# Altium project Jetson Carrier.PrjPcb
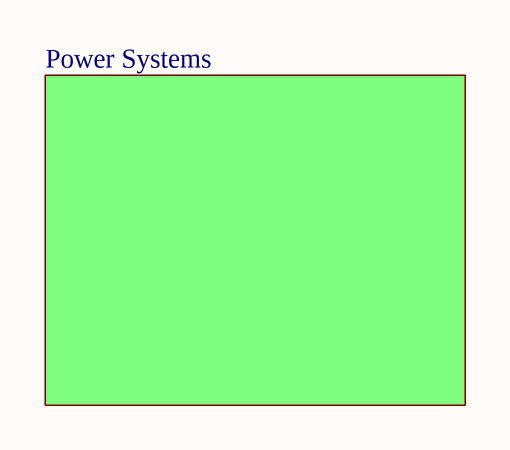
[diagram p0: 01_TOP_LEVEL.SchDoc]
3 sheets, 2 parts. Net scope: flat (ports and power ports of the same name join across sheets).
Sheets:
  01_TOP_LEVEL.SchDoc
    Power Systems = 02_POWER_SYSTEMS.SchDoc
      Module Power = 03_MODULE_POWER.SchDoc

## Sheet 01_TOP_LEVEL.SchDoc
size A4; SheetNumber: 1; SheetTotal: 3

### Sub-sheets
Power Systems = 02_POWER_SYSTEMS: no entries

## Sheet 02_POWER_SYSTEMS.SchDoc
size A4; SheetNumber: 2; SheetTotal: 3
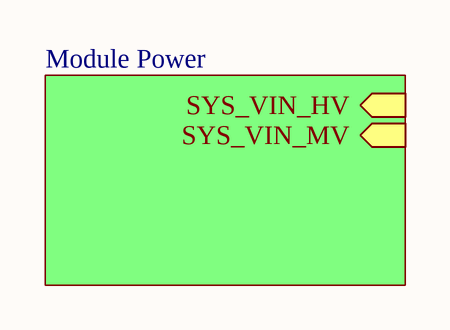
[diagram p1: 02_POWER_SYSTEMS.SchDoc]

### Sub-sheets
Module Power = 03_MODULE_POWER: SYS_VIN_HV (in), SYS_VIN_MV (in)

## Sheet 03_MODULE_POWER.SchDoc
size A4; SheetNumber: 3; SheetTotal: 3
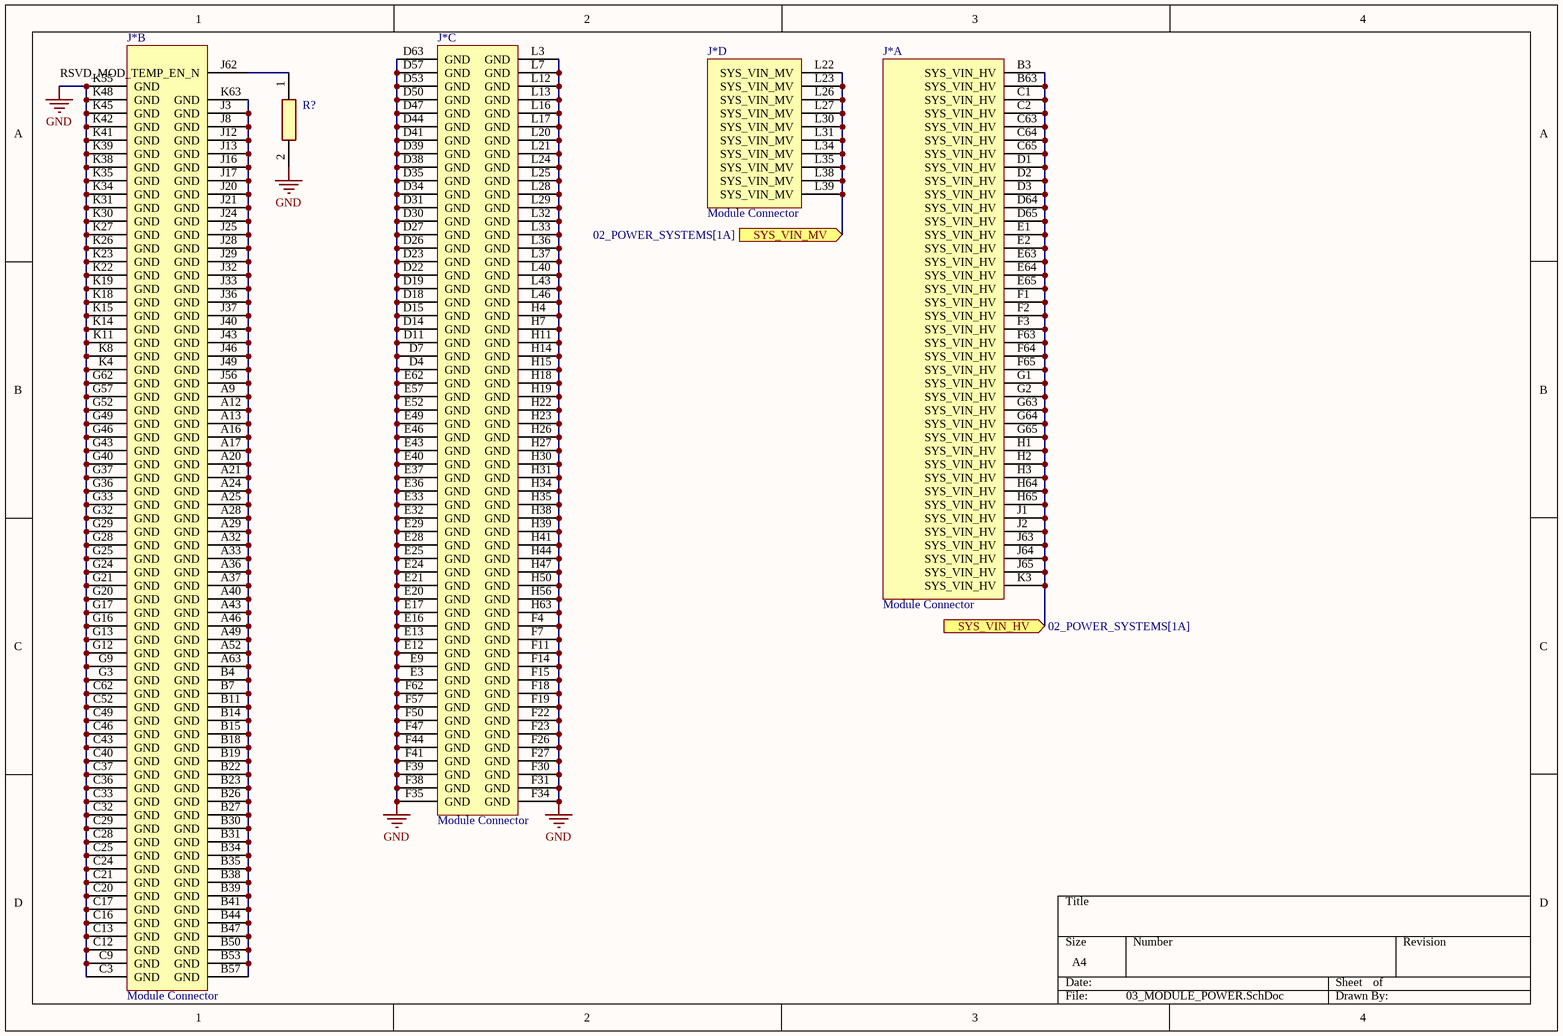
[diagram p2: 03_MODULE_POWER.SchDoc]

### Parts
J*  Module Connector  [2048430001]  (parts A,B,C,D of 4)
R?  0402WGF0000TCE  [RESC1005X40N]  (value not drawn)

### Ports
SYS_VIN_HV (in, see 02_POWER_SYSTEMS[1A]), SYS_VIN_MV (in, see 02_POWER_SYSTEMS[1A])

### Nets
GND: J*.C3(GND) J*.C9(GND) J*.C12(GND) J*.C13(GND) J*.C16(GND) J*.C17(GND) J*.C20(GND) J*.C21(GND) J*.C24(GND) J*.C25(GND) J*.C28(GND) J*.C29(GND) J*.C32(GND) J*.C33(GND) J*.C36(GND) J*.C37(GND) J*.C40(GND) J*.C43(GND) J*.C46(GND) J*.C49(GND) J*.C52(GND) J*.C62(GND) J*.D4(GND) J*.D7(GND) J*.D11(GND) J*.D14(GND) J*.D15(GND) J*.D18(GND) J*.D19(GND) J*.D22(GND) J*.D23(GND) J*.D26(GND) J*.D27(GND) J*.D30(GND) J*.D31(GND) J*.D34(GND) J*.D35(GND) J*.D38(GND) J*.D39(GND) J*.D41(GND) J*.D44(GND) J*.D47(GND) J*.D50(GND) J*.D53(GND) J*.D57(GND) J*.D63(GND) J*.E3(GND) J*.E9(GND) J*.E12(GND) J*.E13(GND) J*.E16(GND) J*.E17(GND) J*.E20(GND) J*.E21(GND) J*.E24(GND) J*.E25(GND) J*.E28(GND) J*.E29(GND) J*.E32(GND) J*.E33(GND) J*.E36(GND) J*.E37(GND) J*.E40(GND) J*.E43(GND) J*.E46(GND) J*.E49(GND) J*.E52(GND) J*.E57(GND) J*.E62(GND) J*.F4(GND) J*.F7(GND) J*.F11(GND) J*.F14(GND) J*.F15(GND) J*.F18(GND) J*.F19(GND) J*.F22(GND) J*.F23(GND) J*.F26(GND) J*.F27(GND) J*.F30(GND) J*.F31(GND) J*.F34(GND) J*.F35(GND) J*.F38(GND) J*.F39(GND) J*.F41(GND) J*.F44(GND) J*.F47(GND) J*.F50(GND) J*.F57(GND) J*.F62(GND) J*.G3(GND) J*.G9(GND) J*.G12(GND) J*.G13(GND) J*.G16(GND) J*.G17(GND) J*.G20(GND) J*.G21(GND) J*.G24(GND) J*.G25(GND) J*.G28(GND) J*.G29(GND) J*.G32(GND) J*.G33(GND) J*.G36(GND) J*.G37(GND) J*.G40(GND) J*.G43(GND) J*.G46(GND) J*.G49(GND) J*.G52(GND) J*.G57(GND) J*.G62(GND) J*.H4(GND) J*.H7(GND) J*.H11(GND) J*.H14(GND) J*.H15(GND) J*.H18(GND) J*.H19(GND) J*.H22(GND) J*.H23(GND) J*.H26(GND) J*.H27(GND) J*.H30(GND) J*.H31(GND) J*.H34(GND) J*.H35(GND) J*.H38(GND) J*.H39(GND) J*.H41(GND) J*.H44(GND) J*.H47(GND) J*.H50(GND) J*.H56(GND) J*.H63(GND) J*.K4(GND) J*.K8(GND) J*.K11(GND) J*.K14(GND) J*.K15(GND) J*.K18(GND) J*.K19(GND) J*.K22(GND) J*.K23(GND) J*.K26(GND) J*.K27(GND) J*.K30(GND) J*.K31(GND) J*.K34(GND) J*.K35(GND) J*.K38(GND) J*.K39(GND) J*.K41(GND) J*.K42(GND) J*.K45(GND) J*.K48(GND) J*.K55(GND) J*.L3(GND) J*.L7(GND) J*.L12(GND) J*.L13(GND) J*.L16(GND) J*.L17(GND) J*.L20(GND) J*.L21(GND) J*.L24(GND) J*.L25(GND) J*.L28(GND) J*.L29(GND) J*.L32(GND) J*.L33(GND) J*.L36(GND) J*.L37(GND) J*.L40(GND) J*.L43(GND) J*.L46(GND) R?.2
NetJ*_A9: J*.A9(GND) J*.A12(GND) J*.A13(GND) J*.A16(GND) J*.A17(GND) J*.A20(GND) J*.A21(GND) J*.A24(GND) J*.A25(GND) J*.A28(GND) J*.A29(GND) J*.A32(GND) J*.A33(GND) J*.A36(GND) J*.A37(GND) J*.A40(GND) J*.A43(GND) J*.A46(GND) J*.A49(GND) J*.A52(GND) J*.A63(GND) J*.B4(GND) J*.B7(GND) J*.B11(GND) J*.B14(GND) J*.B15(GND) J*.B18(GND) J*.B19(GND) J*.B22(GND) J*.B23(GND) J*.B26(GND) J*.B27(GND) J*.B30(GND) J*.B31(GND) J*.B34(GND) J*.B35(GND) J*.B38(GND) J*.B39(GND) J*.B41(GND) J*.B44(GND) J*.B47(GND) J*.B50(GND) J*.B53(GND) J*.B57(GND) J*.J3(GND) J*.J8(GND) J*.J12(GND) J*.J13(GND) J*.J16(GND) J*.J17(GND) J*.J20(GND) J*.J21(GND) J*.J24(GND) J*.J25(GND) J*.J28(GND) J*.J29(GND) J*.J32(GND) J*.J33(GND) J*.J36(GND) J*.J37(GND) J*.J40(GND) J*.J43(GND) J*.J46(GND) J*.J49(GND) J*.J56(GND) J*.K63(GND)
NetJ*_B3: J*.B3(SYS_VIN_HV) J*.B63(SYS_VIN_HV) J*.C1(SYS_VIN_HV) J*.C2(SYS_VIN_HV) J*.C63(SYS_VIN_HV) J*.C64(SYS_VIN_HV) J*.C65(SYS_VIN_HV) J*.D1(SYS_VIN_HV) J*.D2(SYS_VIN_HV) J*.D3(SYS_VIN_HV) J*.D64(SYS_VIN_HV) J*.D65(SYS_VIN_HV) J*.E1(SYS_VIN_HV) J*.E2(SYS_VIN_HV) J*.E63(SYS_VIN_HV) J*.E64(SYS_VIN_HV) J*.E65(SYS_VIN_HV) J*.F1(SYS_VIN_HV) J*.F2(SYS_VIN_HV) J*.F3(SYS_VIN_HV) J*.F63(SYS_VIN_HV) J*.F64(SYS_VIN_HV) J*.F65(SYS_VIN_HV) J*.G1(SYS_VIN_HV) J*.G2(SYS_VIN_HV) J*.G63(SYS_VIN_HV) J*.G64(SYS_VIN_HV) J*.G65(SYS_VIN_HV) J*.H1(SYS_VIN_HV) J*.H2(SYS_VIN_HV) J*.H3(SYS_VIN_HV) J*.H64(SYS_VIN_HV) J*.H65(SYS_VIN_HV) J*.J1(SYS_VIN_HV) J*.J2(SYS_VIN_HV) J*.J63(SYS_VIN_HV) J*.J64(SYS_VIN_HV) J*.J65(SYS_VIN_HV) J*.K3(SYS_VIN_HV) ; port SYS_VIN_HV
NetJ*_J62: J*.J62(RSVD_MOD_TEMP_EN_N) R?.1
NetJ*_L22: J*.L22(SYS_VIN_MV) J*.L23(SYS_VIN_MV) J*.L26(SYS_VIN_MV) J*.L27(SYS_VIN_MV) J*.L30(SYS_VIN_MV) J*.L31(SYS_VIN_MV) J*.L34(SYS_VIN_MV) J*.L35(SYS_VIN_MV) J*.L38(SYS_VIN_MV) J*.L39(SYS_VIN_MV) ; port SYS_VIN_MV

### Library data of the parts
J* = Jetson Connector: 204843-0001
R? = 0402WGF0000TCE: 0 Ohm Resistor / (Not needed but NVIDIA recommends for trouble shooting).; Manufacturer_Name: UNI-ROYAL(Uniroyal Elec); Datasheet Link: https://datasheet.lcsc.com/szlcsc/Uniroyal-Elec-0402WGF0000TCE_C17168.pdf; Height: 0.4mm; Manufacturer_Part_Number: 0402WGF0000TCE